# Altium project Tex01.PrjPCB
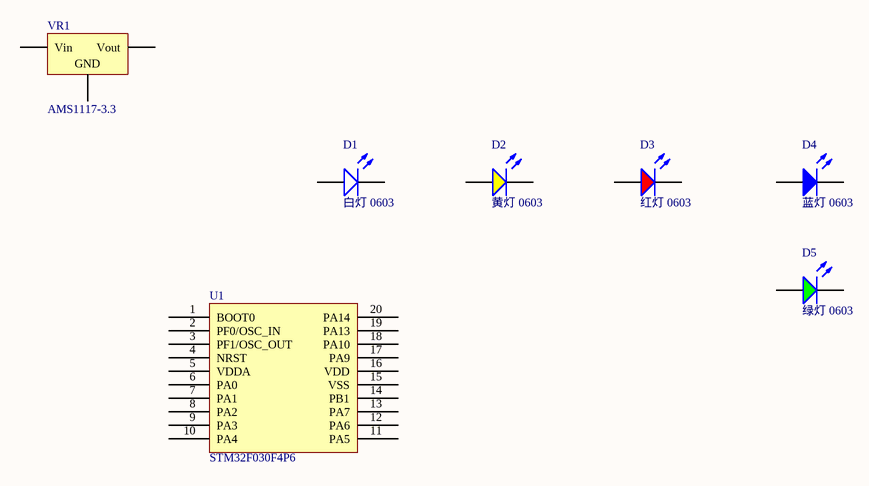
[diagram p0: Sheet1.SchDoc]
1 sheet, 7 parts. Net scope: global (net labels, ports and power ports of the same name join across sheets).
Board file: Tex01.PcbDoc

## Sheet Sheet1.SchDoc
size A4

### Parts
D1  白灯 0603  [0603_LED_S1]
D2  黄灯 0603  [0603_LED_S1]
D3  红灯 0603  [0603_LED_S1]
D4  蓝灯 0603  [0603_LED_S1]
D5  绿灯 0603  [0603_LED_S1]
U1  STM32F030F4P6  [TSSOP-20]
VR1  AMS1117-3.3  [SOT-223]

### Nets

Not connected (* = marked no-connect by the designer): D1 A K; D2 A K; D3 A K; D4 A K; D5 A K; U1 1(BOOT0) 2(PF0/OSC_IN) 3(PF1/OSC_OUT) 4(NRST) 5(VDDA) 6(PA0) 7(PA1) 8(PA2) 9(PA3) 10(PA4) 11(PA5) 12(PA6) 13(PA7) 14(PB1) 15(VSS) 16(VDD) 17(PA9) 18(PA10) 19(PA13) 20(PA14); VR1 1(GND) 2(Vout) 3(Vin)

### Library data of the parts
D1 = 0603 白灯: 发光二极管; ComponentLink1Description: 供应商链接; ComponentLink1URL: http://www.szlcsc.com/product/details_2663.html; Package: 0603; Supplier: LC; SuppliersPartNumber: C2290
D2 = 0603 黄灯: 发光二极管; ComponentLink1Description: 供应商链接; ComponentLink1URL: http://www.szlcsc.com/product/details_73147.html; Package: 0603; Supplier: LC; SuppliersPartNumber: C72038
D3 = 0603 红灯: 发光二极管; ComponentLink1Description: 供应商链接; ComponentLink1URL: http://www.szlcsc.com/product/details_2659.html; Package: 0603; Supplier: LC; SuppliersPartNumber: C2286
D4 = 0603 蓝灯: 发光二极管; ComponentLink1Description: 供应商链接; ComponentLink1URL: http://www.szlcsc.com/product/details_73150.html; Package: 0603; Supplier: LC; SuppliersPartNumber: C72041
D5 = 0603 绿灯: 发光二极管; ComponentLink1Description: 供应商链接; ComponentLink1URL: http://www.szlcsc.com/product/details_73152.html; Package: 0603; Supplier: LC; SuppliersPartNumber: C72043
U1 = STM32F030F4P6: ARM; ComponentLink1Description: 供应商链接; ComponentLink1URL: http://www.szlcsc.com/product/details_33873.html; Package: TSSOP-20; Supplier: LC; SuppliersPartNumber: C32908
VR1 = SOT-223 AMS1117-3.3: 低压差线性稳压(LDO); ComponentLink1Description: 供应商链接; ComponentLink1URL: http://www.szlcsc.com/product/details_6652.html; Package: SOT-223; Supplier: LC; SuppliersPartNumber: C6186